# Altium schematic sheet nufsr-user-io.schdoc: NUSense
size A4; Organization: Elby Designs; Address1: 9 Follan Close; Address2: Kariong; Address3: NSW 2250; Address4: Australia; Revision: 1; SheetNumber: 6; SheetTotal: 15; DrawnBy: User Interface; Engineer: Laurie Biddulph; PageSetup: Record=PageOptions|CenterHorizontal=True|CenterVertical=True|PrintScale=1.38|XCorrection=1.00|YCorrection=1.00|PrintKind=1|BorderSize=5000000|LeftOffset=0|BottomOffset=0|Orientation=2|PaperLength=1000|PaperWidth=1000|Scale=100|PaperSource=7|PrintQuality=-4|MediaType=1|DitherType=10|PaperKind=A3|PrintScaleMode=1
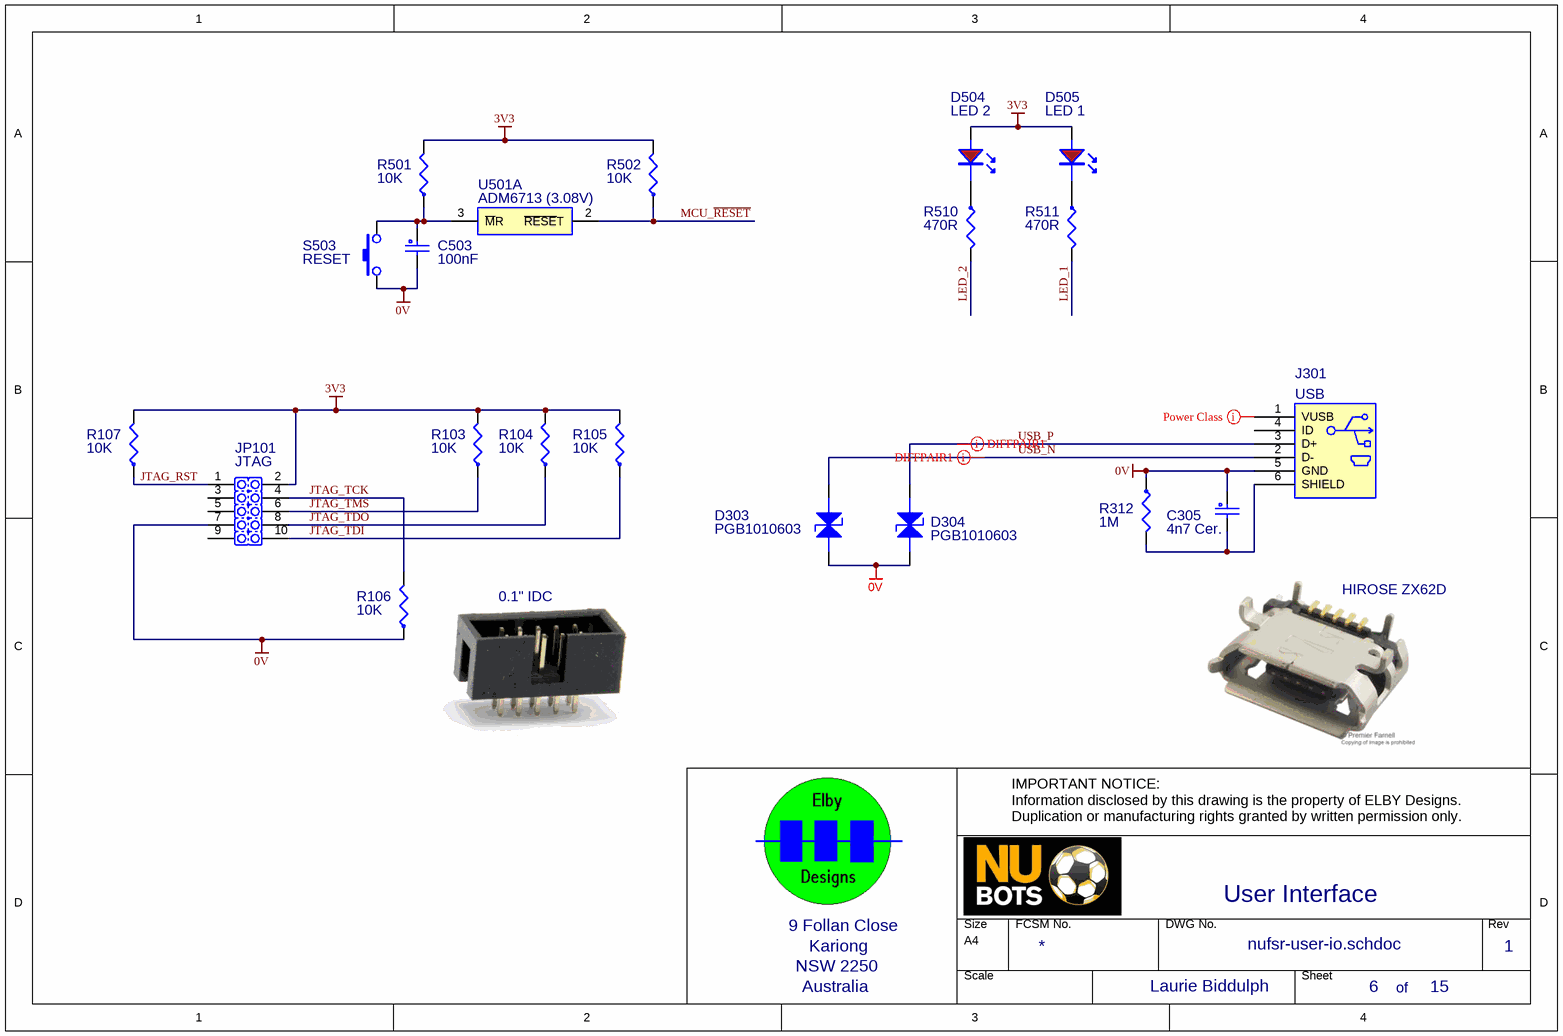
[diagram p0: nufsr-user-io.schdoc]

## Parts
C305  4n7 Cer.  [0603(LB)]
C503  100nF  [0603(LB)]
D303  PGB1010603  [0603(LB)]
D304  PGB1010603  [0603(LB)]
D504  LED 2  [LED-0603(LB)]
D505  LED 1  [LED-0603(LB)]
J301  USB  [USB-ZX62D]
JP101  JTAG  [HDR2X5(LB)]
R103  10K  [0603(LB)]
R104  10K  [0603(LB)]
R105  10K  [0603(LB)]
R106  10K  [0603(LB)]
R107  10K  [0603(LB)]
R312  1M  [0603(LB)]
R501  10K  [0603(LB)]
R502  10K  [0603(LB)]
R510  470R  [0603(LB)]
R511  470R  [0603(LB)]
S503  RESET  [HDR1X2(LB)]
U501  ADM6713 (3.08V)  [SC70-4]  (part A of 2)

## Nets
0V: C305.1 C503.2 D303.2 D304.2 J301.5(GND) JP101.7 R106.1 R312.1 S503.1(COM)
3V3: D504.A D505.A JP101.2 R103.2 R104.2 R105.2 R107.2 R501.2 R502.2
JTAG_RST: JP101.1 R107.1
JTAG_TCK: JP101.4 R106.2
JTAG_TDI: JP101.10 R105.1
JTAG_TDO: JP101.8 R104.1
JTAG_TMS: JP101.6 R103.1
LED_1: R511.2
LED_2: R510.2
MCU_~{RESET}: R502.1 U501.2(~{RESE}T)
USB_N: D303.1 J301.2(D-)
USB_P: D304.1 J301.3(D+)
NetC305_2: C305.2 J301.6(SHIELD) R312.2
NetC503_1: C503.1 R501.1 S503.2(NO) U501.3(~{M}R)
NetD504_K: D504.K R510.1
NetD505_K: D505.K R511.1

Not connected (* = marked no-connect by the designer): J301 1(VUSB) 4(ID); JP101 3 5 9

## Layout directives
net class PowerClass: NetJ301_1
differential pair: USB_N, USB_P

## Notes on the sheet
- 0.1" IDC
- HIROSE ZX62D
- IMPORTANT NOTICE:
  Information disclosed by this drawing is the property of ELBY Designs.
  Duplication or manufacturing rights granted by written permission only.
- of

## Library data of the parts
C305 = CC-4700PF(LB): 4700pF NPO, 50VDC Ceramic Disc; EMRP: CC-4700PF
C503 = CC-100NF(LB): Monolithic Ceramic; EMRP: CC-100NF
D303 D304 = PGB1010603: 500V Pulse-Guard; EMRP: SD-TRANSORB
D504 D505 = LED-RED(LB): LED
J301 = ZX62D-B-5P8
JP101 = HDR2X5(LB): Connector
R103-R107 R501 R502 = RM-10K(LB): 0.5W 1% Metal Film Resistor; EMRP: RM-10K
R312 = RM-1M(LB): 0.5W 1% Metal Film Resistor; EMRP: RM-1M
R510 R511 = RM-470R(LB): 0.5W 1% Metal Film Resistor; EMRP: RM-470R
S503 = SW-PB-SPST(LB): PCB Push-button Switch; Text Field2: SP-0600
U501 = ADM6713: Microprocessor Supervisory Circuit